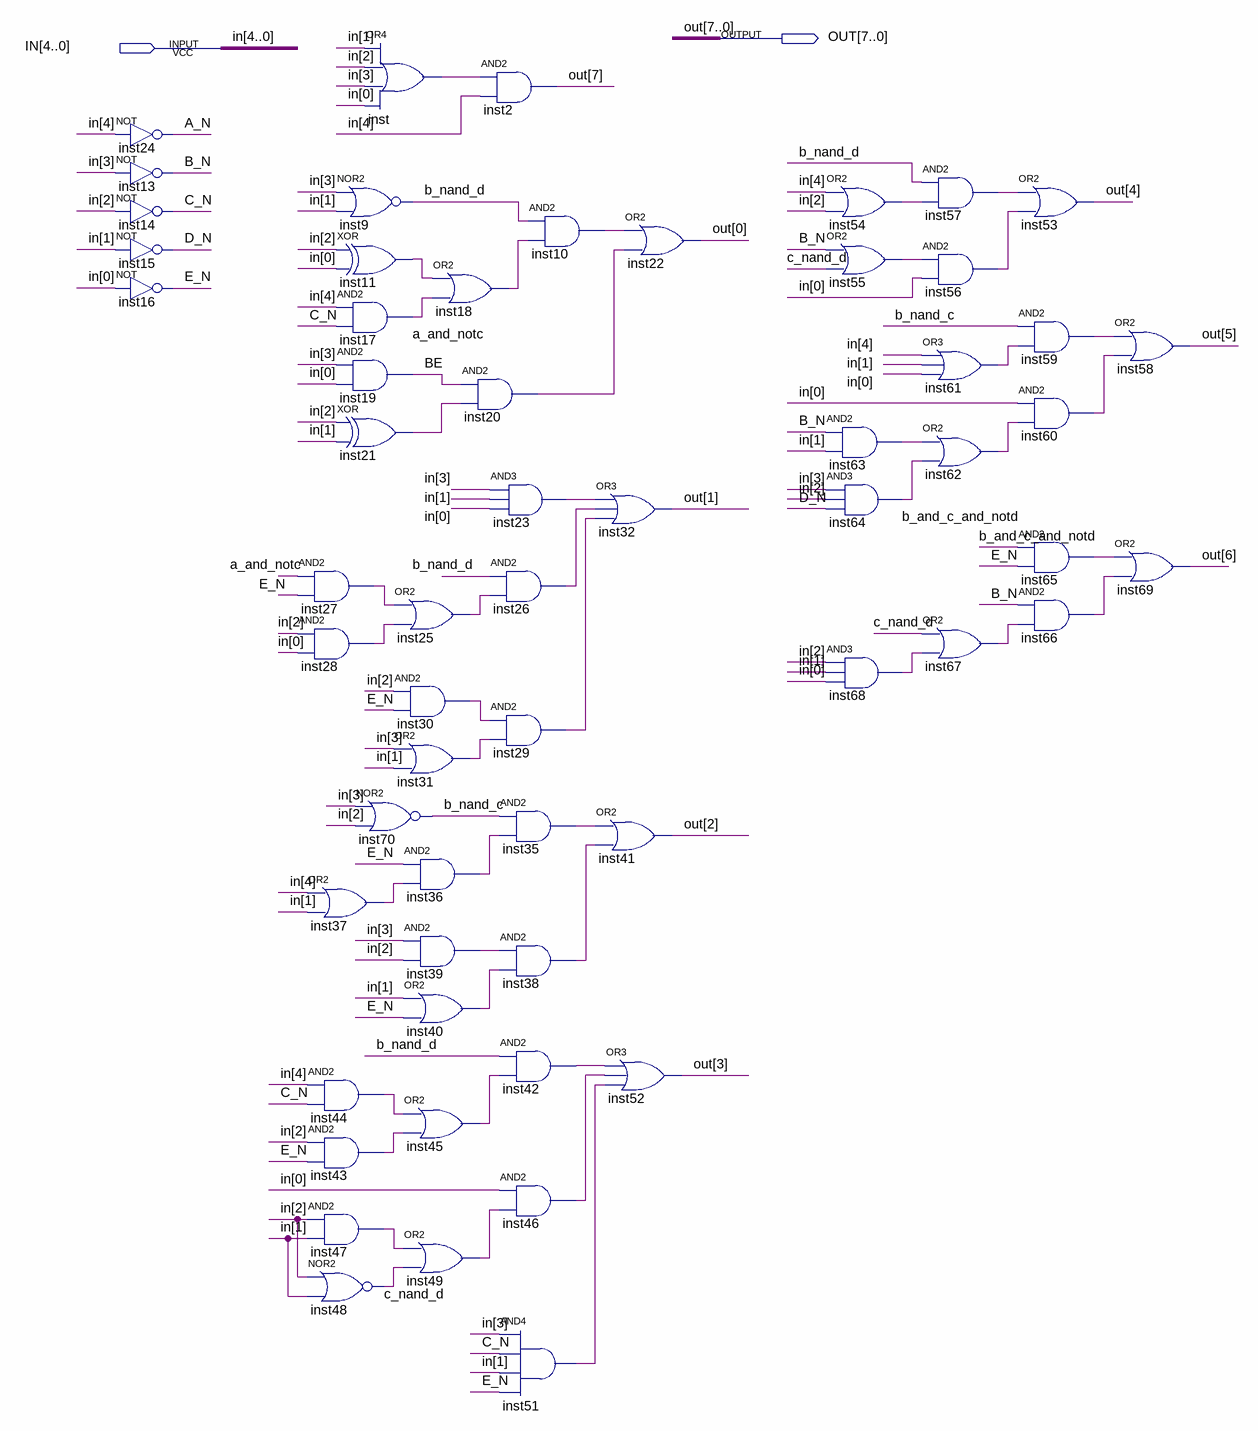
[diagram p0: schematic sheet]
// Quartus schematic Display5bits.bdf as structural Verilog: 60 symbols, 2 pins
module Display5bits (
  input  [4:0] IN,
  output [7:0] OUT
);

  wire a_and_notc, A_N, b_and_c_and_notd, B_N, b_nand_c, b_nand_d, BE, C_N, c_nand_d, D_N, E_N, inst10_out,
       inst11_out, inst18_out, inst20_out, inst21_out, inst23_out, inst25_out, inst26_out, inst27_out,
       inst28_out, inst29_out, inst30_out, inst31_out, inst35_out, inst36_out, inst37_out, inst38_out,
       inst39_out, inst40_out, inst42_out, inst43_out, inst44_out, inst45_out, inst46_out, inst47_out,
       inst49_out, inst51_out, inst54_out, inst55_out, inst56_out, inst57_out, inst59_out, inst60_out,
       inst61_out, inst62_out, inst63_out, inst65_out, inst66_out, inst67_out, inst68_out, inst_out;

  not inst24 (A_N, IN[4]);
  not inst13 (B_N, IN[3]);
  not inst14 (C_N, IN[2]);
  not inst15 (D_N, IN[1]);
  not inst16 (E_N, IN[0]);
  or inst (inst_out, IN[1], IN[2], IN[3], IN[0]);
  nor inst9 (b_nand_d, IN[3], IN[1]);
  xor inst11 (inst11_out, IN[2], IN[0]);
  and inst17 (a_and_notc, IN[4], C_N);
  and inst19 (BE, IN[3], IN[0]);
  xor inst21 (inst21_out, IN[2], IN[1]);
  and inst27 (inst27_out, a_and_notc, E_N);
  and inst28 (inst28_out, IN[2], IN[0]);
  nor inst70 (b_nand_c, IN[3], IN[2]);
  or inst37 (inst37_out, IN[4], IN[1]);
  and inst44 (inst44_out, IN[4], C_N);
  and inst43 (inst43_out, IN[2], E_N);
  and inst47 (inst47_out, IN[2], IN[1]);
  nor inst48 (c_nand_d, IN[2], IN[1]);
  or inst18 (inst18_out, inst11_out, a_and_notc);
  or inst25 (inst25_out, inst27_out, inst28_out);
  and inst30 (inst30_out, IN[2], E_N);
  or inst31 (inst31_out, IN[3], IN[1]);
  and inst36 (inst36_out, E_N, inst37_out);
  and inst39 (inst39_out, IN[3], IN[2]);
  or inst40 (inst40_out, IN[1], E_N);
  or inst45 (inst45_out, inst44_out, inst43_out);
  or inst49 (inst49_out, inst47_out, c_nand_d);
  and inst2 (OUT[7], inst_out, IN[4]);
  and inst20 (inst20_out, BE, inst21_out);
  and inst23 (inst23_out, IN[3], IN[1], IN[0]);
  and inst26 (inst26_out, b_nand_d, inst25_out);
  and inst29 (inst29_out, inst30_out, inst31_out);
  and inst35 (inst35_out, b_nand_c, inst36_out);
  and inst38 (inst38_out, inst39_out, inst40_out);
  and inst42 (inst42_out, b_nand_d, inst45_out);
  and inst46 (inst46_out, IN[0], inst49_out);
  and inst51 (inst51_out, IN[3], C_N, IN[1], E_N);
  and inst10 (inst10_out, b_nand_d, inst18_out);
  or inst32 (OUT[1], inst23_out, inst26_out, inst29_out);
  or inst41 (OUT[2], inst35_out, inst38_out);
  or inst22 (OUT[0], inst10_out, inst20_out);
  or inst52 (OUT[3], inst42_out, inst46_out, inst51_out);
  or inst54 (inst54_out, IN[4], IN[2]);
  or inst55 (inst55_out, B_N, c_nand_d);
  and inst63 (inst63_out, B_N, IN[1]);
  and inst64 (b_and_c_and_notd, IN[3], IN[2], D_N);
  and inst68 (inst68_out, IN[2], IN[1], IN[0]);
  and inst57 (inst57_out, b_nand_d, inst54_out);
  and inst56 (inst56_out, inst55_out, IN[0]);
  or inst61 (inst61_out, IN[4], IN[1], IN[0]);
  or inst62 (inst62_out, inst63_out, b_and_c_and_notd);
  or inst67 (inst67_out, c_nand_d, inst68_out);
  or inst53 (OUT[4], inst57_out, inst56_out);
  and inst59 (inst59_out, b_nand_c, inst61_out);
  and inst60 (inst60_out, IN[0], inst62_out);
  and inst65 (inst65_out, b_and_c_and_notd, E_N);
  and inst66 (inst66_out, B_N, inst67_out);
  or inst58 (OUT[5], inst59_out, inst60_out);
  or inst69 (OUT[6], inst65_out, inst66_out);
endmodule
